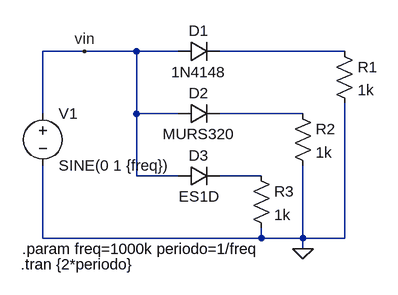
[diagram p0: schematic diode_comparison_vd.asc]
diode_comparison_vd.asc, the LTspice schematic file:
Version 4
SHEET 1 880 680
WIRE -48 -64 -112 -64
WIRE 32 -64 -48 -64
WIRE 96 -64 32 -64
WIRE 352 -64 160 -64
WIRE -112 32 -112 -64
WIRE 32 32 32 -64
WIRE 96 32 32 32
WIRE 288 32 160 32
WIRE 32 128 32 32
WIRE 96 128 32 128
WIRE 224 128 160 128
WIRE -112 224 -112 112
WIRE 224 224 224 208
WIRE 224 224 -112 224
WIRE 288 224 288 112
WIRE 288 224 224 224
WIRE 352 224 352 16
WIRE 352 224 288 224
WIRE 288 240 288 224
FLAG 288 240 0
FLAG -48 -64 vin
SYMBOL voltage -112 16 R0
WINDOW 123 0 0 Left 0
WINDOW 39 0 0 Left 0
SYMATTR InstName V1
SYMATTR Value SINE(0 1 {freq})
SYMBOL diode 96 -48 R270
WINDOW 0 32 32 VTop 2
WINDOW 3 0 32 VBottom 2
SYMATTR InstName D1
SYMATTR Value 1N4148
SYMBOL diode 96 48 R270
WINDOW 0 32 32 VTop 2
WINDOW 3 0 32 VBottom 2
SYMATTR InstName D2
SYMATTR Value MURS320
SYMBOL diode 96 144 R270
WINDOW 0 32 32 VTop 2
WINDOW 3 0 32 VBottom 2
SYMATTR InstName D3
SYMATTR Value ES1D
SYMBOL res 336 -80 R0
SYMATTR InstName R1
SYMATTR Value 1k
SYMBOL res 272 16 R0
SYMATTR InstName R2
SYMATTR Value 1k
SYMBOL res 208 112 R0
SYMATTR InstName R3
SYMATTR Value 1k
TEXT -146 264 Left 2 !.tran {2*periodo}
TEXT -144 240 Left 2 !.param freq=1000k periodo=1/freq

The netlist it stands for:
* diode_comparison_vd.asc
V1 vin 0 SINE(0 1 {freq})
D1 vin N001 1N4148
D2 vin N002 MURS320
D3 vin N003 ES1D
R1 N001 0 1k
R2 N002 0 1k
R3 N003 0 1k
.model D D
.lib standard.dio
.tran {2*periodo}
.param freq=1000k periodo=1/freq
.backanno
.end